# EAGLE schematic RELAY CONTACT BOUNCE ELIMINATOR_REV 2 (EAGLE 9.6.2)
DOC_NAME: CAN BUS CONTROLLER; DOC_REVISION: 2; INITIALS_DRAWN: KJD
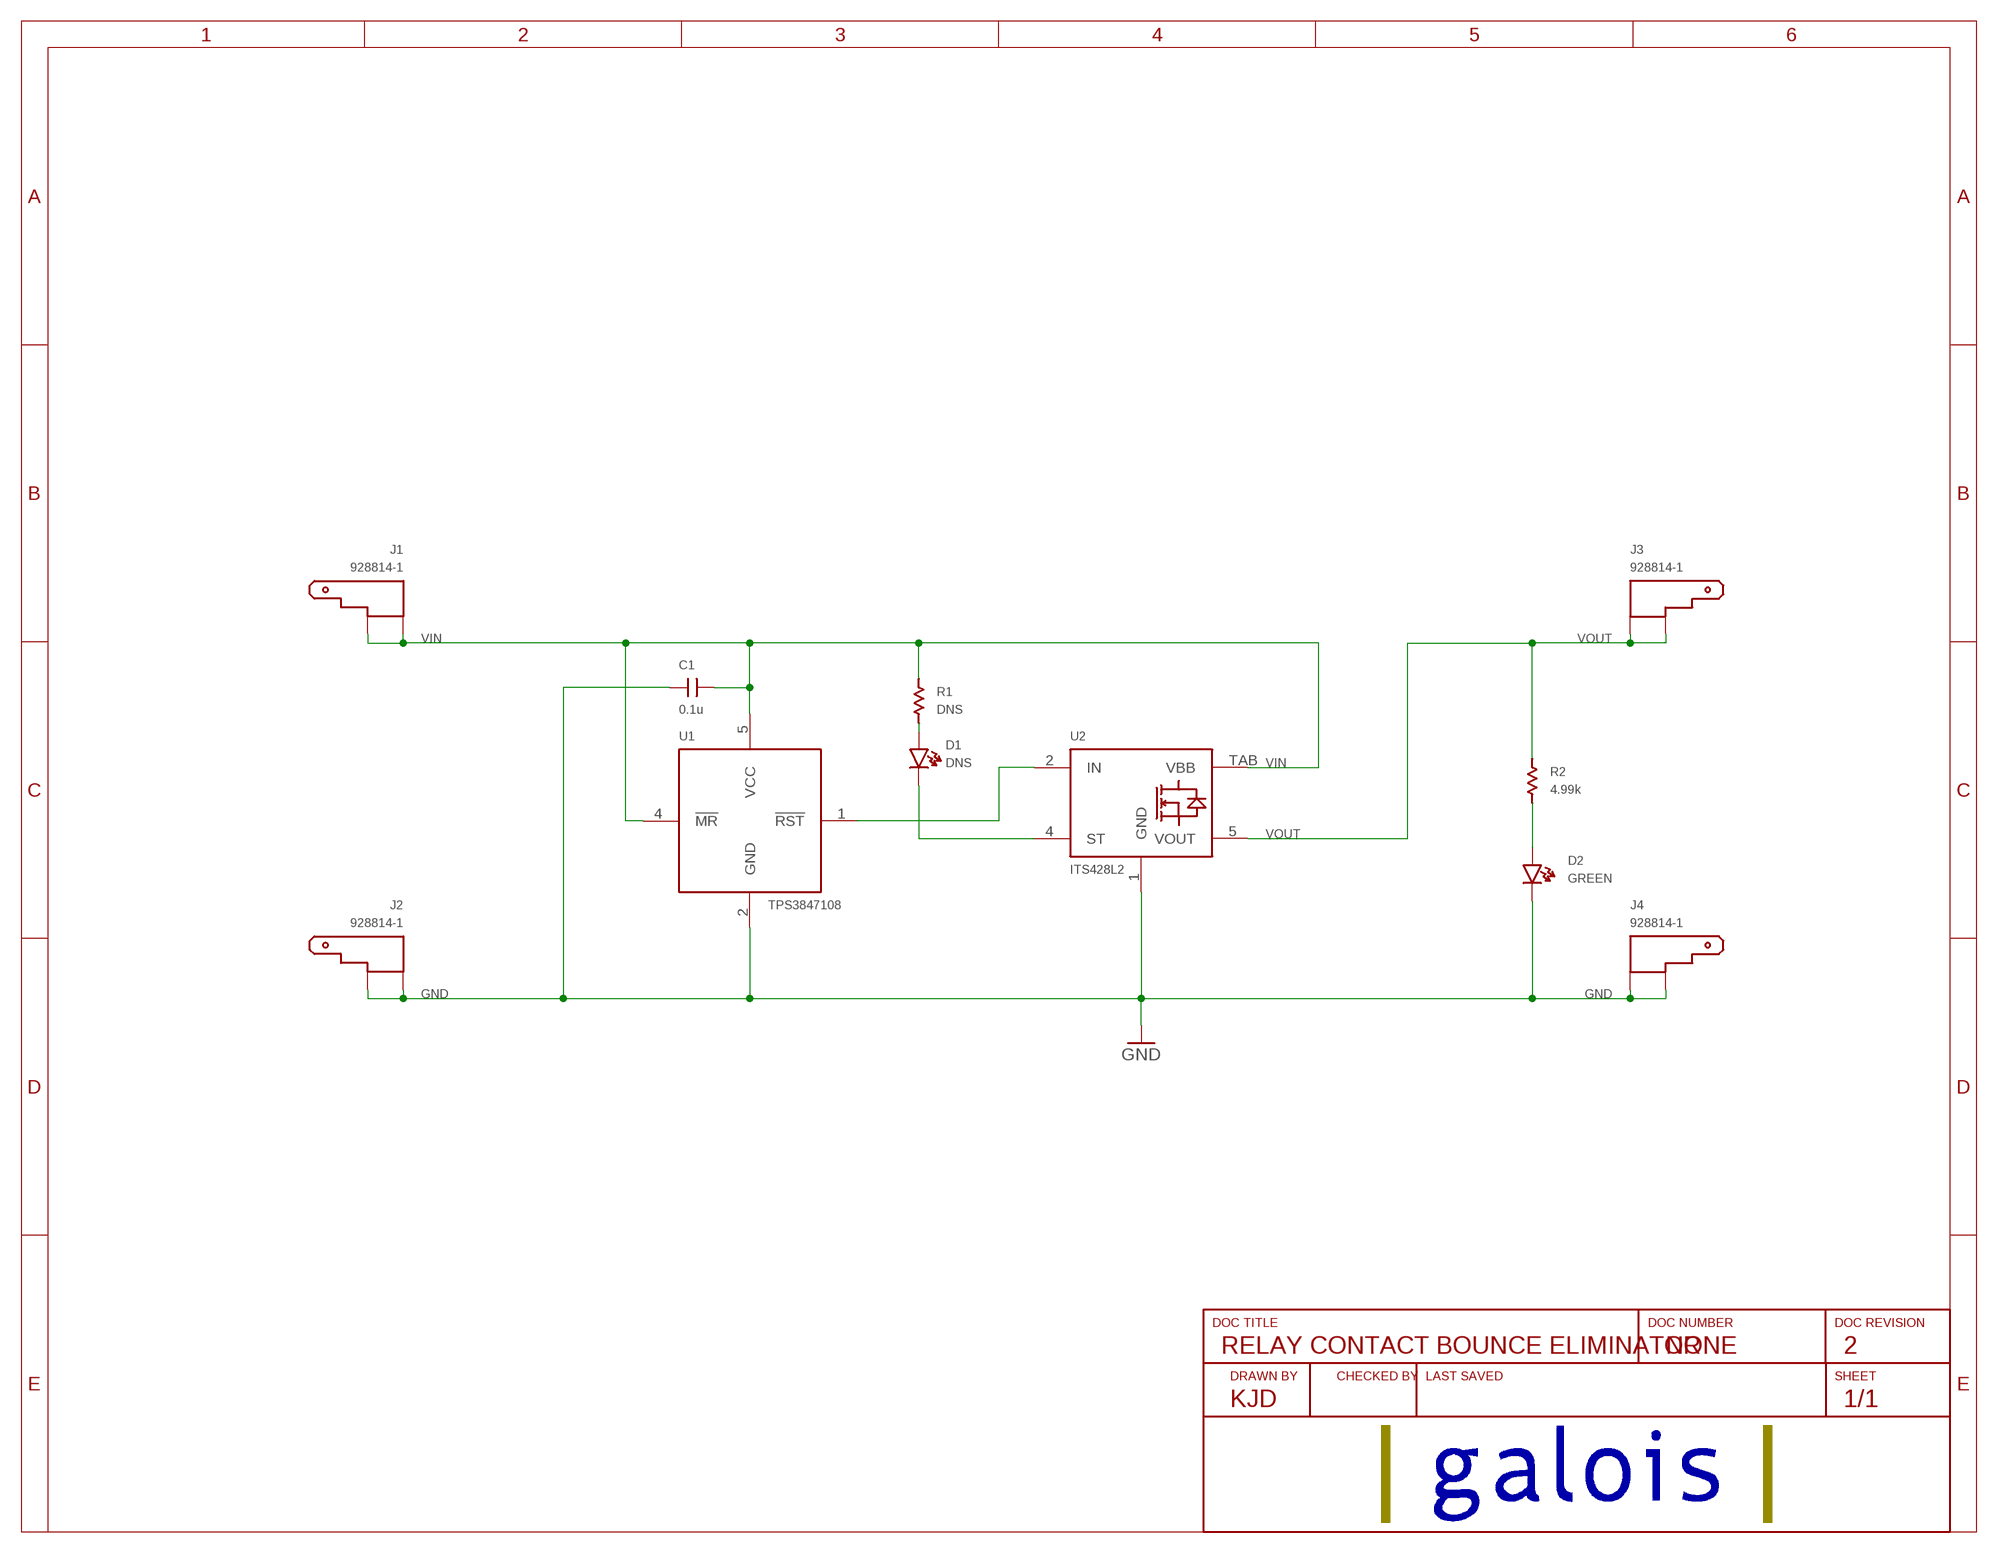
[diagram p0: schematic, sheet 1]

## Parts
C1  0.1u  C_SMDC0603  [EIA0603]
D1  DNS  LED_SMD  [EIA0603_LED]
D2  GREEN  LED_SMD  [EIA0603_LED]
J1  928814-1  FASTON_PCB_THRU_R/A  [FASTON_MALE_SERIES_250_THRU_R/A]
J2  928814-1  FASTON_PCB_THRU_R/A  [FASTON_MALE_SERIES_250_THRU_R/A]
J3  928814-1  FASTON_PCB_THRU_R/A  [FASTON_MALE_SERIES_250_THRU_R/A]
J4  928814-1  FASTON_PCB_THRU_R/A  [FASTON_MALE_SERIES_250_THRU_R/A]
R1  DNS  R_SMDR0603  [EIA0603]
R2  4.99k  R_SMDR0603  [EIA0603]
U1  TPS3847108  TPS3847  [SOT23-5]
U2  ITS428L2  [PG-TO252-5-11]

## Nets
GND: C1.P$1 D2.C J2.1 J2.2 J4.1 J4.2 U1.2(GND) U2.1(GND)
N$1: D2.A R2.P$1
N$2: D1.A R1.P$1
N$3: U1.1(!RST) U2.2(IN)
N$4: D1.C U2.4(ST)
VIN: C1.P$2 J1.1 J1.2 R1.P$2 U1.4(!MR) U1.5(VCC) U2.TAB(VBB)
VOUT: J3.1 J3.2 R2.P$2 U2.5(VOUT)

## Notes on the sheet
- RELAY CONTACT BOUNCE ELIMINATOR | NONE | 2
- KJD

## Library data of the parts
C1 = USER_SMT_CHIP_STANDARD:C_SMD; MPN: CL10B104KB8NNNC; PACKAGE: 0603
D1 = USER_SMT_CHIP_STANDARD:LED_SMD; MPN: DNS
D2 = USER_SMT_CHIP_STANDARD:LED_SMD; MPN: LG Q396-PS-35
J1-J4 = USER_CON_HIGH_CURRENT:FASTON_PCB_THRU_R/A; MPN: 928814-1
R1 = USER_SMT_CHIP_STANDARD:R_SMD; MPN: DNS; PACKAGE: 0603
R2 = USER_SMT_CHIP_STANDARD:R_SMD; MPN: ERJ-3EKF4991V; PACKAGE: 0603
U1 = USER_PMIC:TPS3847; MPN: TPS3847108DBVR
U2 = USER_SMART_SWITCHES:ITS428L2; MPN: ITS428L2ATMA1